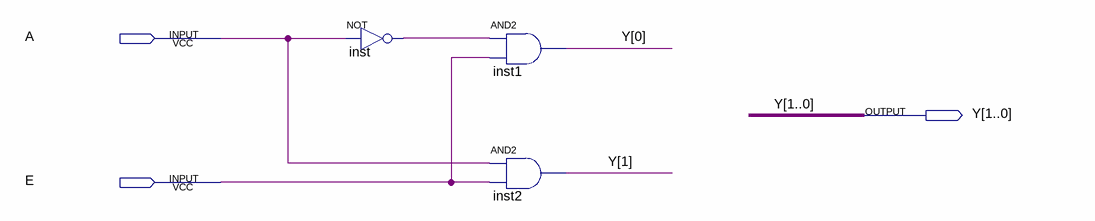
[diagram p0: schematic sheet]
// Quartus schematic DECODER_1_TO_2.bdf as structural Verilog: 3 symbols, 3 pins
module DECODER_1_TO_2 (
  input  A,
  input  E,
  output [1:0] Y
);

  wire inst_out;

  not inst (inst_out, A);
  and inst1 (Y[0], inst_out, E);
  and inst2 (Y[1], A, E);
endmodule
